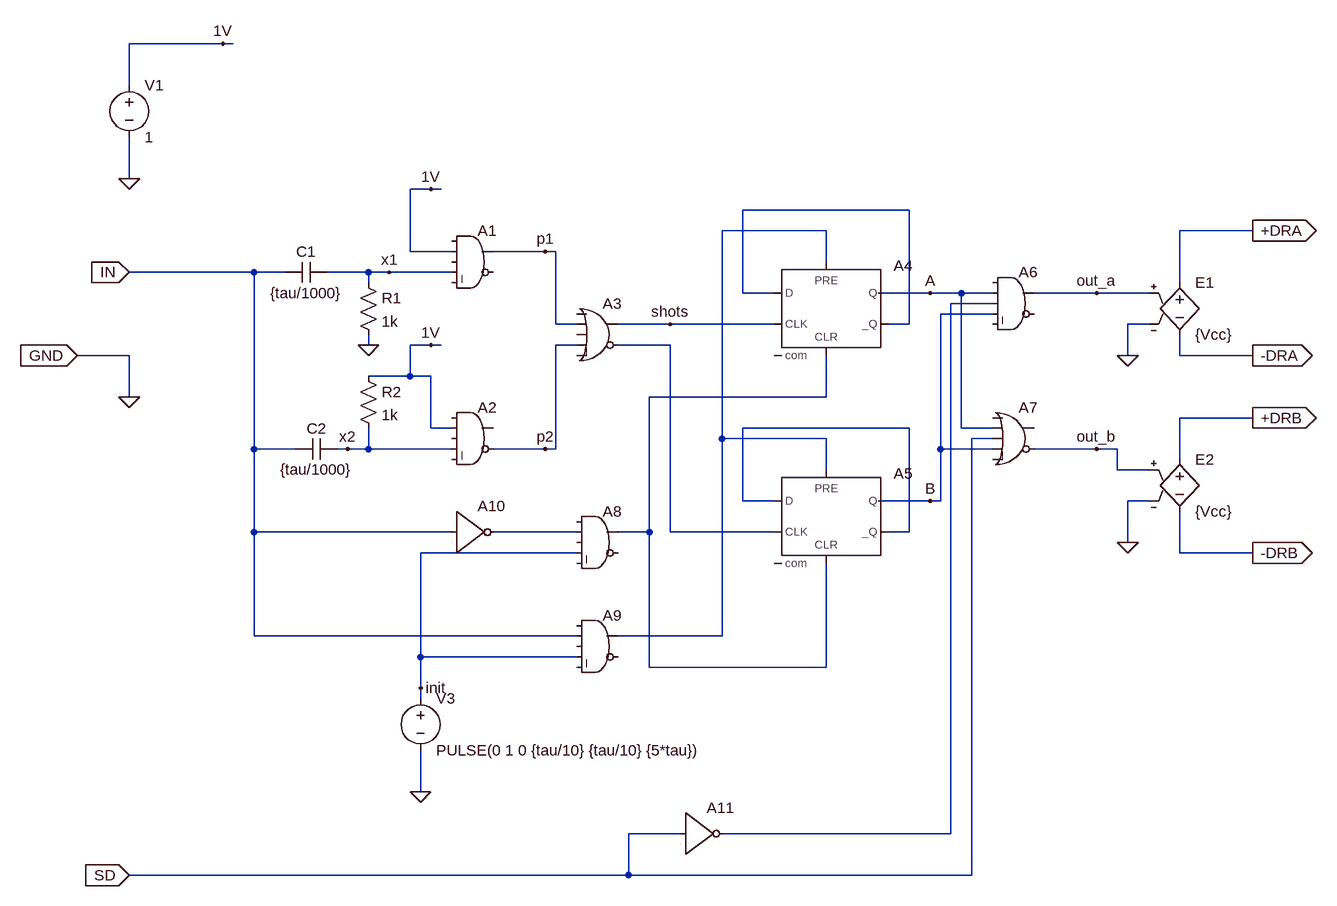
[diagram p0: schematic Half-Bridge-Driver.asc]
Half-Bridge-Driver.asc, the LTspice schematic file:
Version 4
SHEET 1 1808 1240
WIRE 96 -112 -48 -112
WIRE 112 -112 96 -112
WIRE -48 -48 -48 -112
WIRE -48 96 -48 32
WIRE 416 112 384 112
WIRE 432 112 416 112
WIRE 1152 144 896 144
WIRE 1024 176 864 176
WIRE 1680 176 1568 176
WIRE 384 208 384 112
WIRE 448 208 384 208
WIRE 592 208 512 208
WIRE 608 208 592 208
WIRE 1024 224 1024 176
WIRE 144 240 -48 240
WIRE 192 240 144 240
WIRE 320 240 256 240
WIRE 352 240 320 240
WIRE 448 240 352 240
WIRE 320 256 320 240
WIRE 1568 256 1568 176
WIRE 896 272 896 144
WIRE 944 272 896 272
WIRE 1184 272 1104 272
WIRE 1232 272 1184 272
WIRE 1280 272 1232 272
WIRE 1440 272 1344 272
WIRE 1520 272 1440 272
WIRE 1280 288 1216 288
WIRE 1280 304 1200 304
WIRE 608 320 608 208
WIRE 640 320 608 320
WIRE 784 320 704 320
WIRE 944 320 784 320
WIRE 1152 320 1152 144
WIRE 1152 320 1120 320
WIRE 1520 320 1488 320
WIRE 320 352 320 336
WIRE 416 352 384 352
WIRE 432 352 416 352
WIRE 640 352 608 352
WIRE 784 352 704 352
WIRE -48 368 -128 368
WIRE 1488 368 1488 320
WIRE 1568 368 1568 336
WIRE 1680 368 1568 368
WIRE 384 400 384 352
WIRE 384 400 320 400
WIRE 416 400 384 400
WIRE -48 432 -48 368
WIRE 1024 432 1024 368
WIRE 1024 432 752 432
WIRE 1680 464 1568 464
WIRE 416 480 416 400
WIRE 448 480 416 480
WIRE 1152 480 896 480
WIRE 1232 480 1232 272
WIRE 1280 480 1232 480
WIRE 864 496 864 176
WIRE 1024 496 864 496
WIRE 1280 496 1248 496
WIRE 144 512 144 240
WIRE 208 512 144 512
WIRE 288 512 272 512
WIRE 320 512 320 480
WIRE 320 512 288 512
WIRE 448 512 320 512
WIRE 592 512 512 512
WIRE 608 512 608 352
WIRE 608 512 592 512
WIRE 1200 512 1200 304
WIRE 1280 512 1200 512
WIRE 1440 512 1344 512
WIRE 1472 512 1440 512
WIRE 1568 528 1568 464
WIRE 1024 544 1024 496
WIRE 1472 544 1472 512
WIRE 1520 544 1472 544
WIRE 896 592 896 480
WIRE 944 592 896 592
WIRE 1184 592 1104 592
WIRE 1200 592 1200 512
WIRE 1200 592 1184 592
WIRE 1520 592 1488 592
WIRE 144 640 144 512
WIRE 448 640 144 640
WIRE 640 640 512 640
WIRE 752 640 752 432
WIRE 752 640 704 640
WIRE 784 640 784 352
WIRE 944 640 784 640
WIRE 1152 640 1152 480
WIRE 1152 640 1120 640
WIRE 1488 656 1488 592
WIRE 640 672 400 672
WIRE 1568 672 1568 608
WIRE 1680 672 1568 672
WIRE 144 800 144 640
WIRE 640 800 144 800
WIRE 864 800 864 496
WIRE 864 800 704 800
WIRE 400 832 400 672
WIRE 640 832 400 832
WIRE 752 848 752 640
WIRE 1024 848 1024 688
WIRE 1024 848 752 848
WIRE 400 880 400 832
WIRE 400 896 400 880
WIRE 400 1040 400 976
WIRE 800 1104 720 1104
WIRE 1216 1104 1216 288
WIRE 1216 1104 864 1104
WIRE 720 1168 720 1104
WIRE 720 1168 -48 1168
WIRE 1248 1168 1248 496
WIRE 1248 1168 720 1168
FLAG -48 96 0
FLAG 96 -112 1V
FLAG -48 432 0
FLAG 320 352 0
FLAG 400 1040 0
FLAG 1440 272 out_a
FLAG 1440 512 out_b
FLAG 352 240 x1
FLAG 288 512 x2
FLAG 416 112 1V
FLAG 416 352 1V
FLAG 400 880 init
FLAG -48 240 IN
IOPIN -48 240 In
FLAG -128 368 GND
IOPIN -128 368 In
FLAG 592 208 p1
FLAG 592 512 p2
FLAG 784 320 shots
FLAG 1184 272 A
FLAG 1184 592 B
FLAG 1488 368 0
FLAG 1488 656 0
FLAG 1680 176 +DRA
IOPIN 1680 176 Out
FLAG 1680 368 -DRA
IOPIN 1680 368 Out
FLAG 1680 464 +DRB
IOPIN 1680 464 Out
FLAG 1680 672 -DRB
IOPIN 1680 672 Out
FLAG -48 1168 SD
IOPIN -48 1168 In
SYMBOL voltage -48 -64 R0
WINDOW 123 0 0 Left 0
WINDOW 39 0 0 Left 0
SYMATTR InstName V1
SYMATTR Value 1
SYMBOL cap 256 224 R90
WINDOW 0 0 32 VBottom 2
WINDOW 3 32 32 VTop 2
SYMATTR InstName C1
SYMATTR Value {tau/1000}
SYMBOL cap 272 496 R90
WINDOW 0 0 32 VBottom 2
WINDOW 3 32 32 VTop 2
SYMATTR InstName C2
SYMATTR Value {tau/1000}
SYMBOL res 304 240 R0
SYMATTR InstName R1
SYMATTR Value 1k
SYMBOL res 304 384 R0
SYMATTR InstName R2
SYMATTR Value 1k
SYMBOL Digital\\and 480 160 R0
SYMATTR InstName A1
SYMBOL Digital\\and 480 432 R0
SYMATTR InstName A2
SYMBOL Digital\\or 672 272 R0
SYMATTR InstName A3
SYMBOL Digital\\dflop 1024 224 R0
SYMATTR InstName A4
SYMBOL Digital\\dflop 1024 544 R0
SYMATTR InstName A5
SYMBOL Digital\\and 1312 224 R0
SYMATTR InstName A6
SYMBOL Digital\\or 1312 432 R0
SYMATTR InstName A7
SYMBOL Digital\\and 672 592 R0
SYMATTR InstName A8
SYMBOL Digital\\and 672 752 R0
SYMATTR InstName A9
SYMBOL Digital\\inv 448 576 R0
SYMATTR InstName A10
SYMBOL voltage 400 880 R0
WINDOW 123 0 0 Left 0
WINDOW 39 0 0 Left 0
SYMATTR InstName V3
SYMATTR Value PULSE(0 1 0 {tau/10} {tau/10} {5*tau})
SYMBOL e 1568 240 R0
SYMATTR InstName E1
SYMATTR Value {Vcc}
SYMBOL e 1568 512 R0
SYMATTR InstName E2
SYMATTR Value {Vcc}
SYMBOL Digital\\inv 800 1040 R0
SYMATTR InstName A11

The netlist it stands for:
* Half-Bridge-Driver.asc
V1 1V 0 1
C1 x1 IN {tau/1000}
C2 x2 IN {tau/1000}
R1 x1 0 1k
R2 1V x2 1k
A1 0 1V 0 x1 0 0 p1 0 AND
A2 0 1V 0 x2 0 p2 0 0 AND
A3 0 p1 0 p2 0 N004 shots 0 OR
A4 N001 0 shots N002 N005 N001 A 0 DFLOP
A5 N006 0 N004 N002 N005 N006 B 0 DFLOP
A6 0 A N003 B 0 0 out_a 0 AND
A7 0 A SD B 0 out_b 0 0 OR
A8 0 N007 0 init 0 0 N005 0 AND
A9 0 IN 0 init 0 0 N002 0 AND
A10 IN 0 0 0 0 N007 0 0 BUF
V3 init 0 PULSE(0 1 0 {tau/10} {tau/10} {5*tau})
E1 +DRA -DRA out_a 0 {Vcc}
E2 +DRB -DRB out_b 0 {Vcc}
A11 SD 0 0 0 0 N003 0 0 BUF
.backanno
.end